# EAGLE schematic AP_Board_1 (EAGLE 7.2.0)
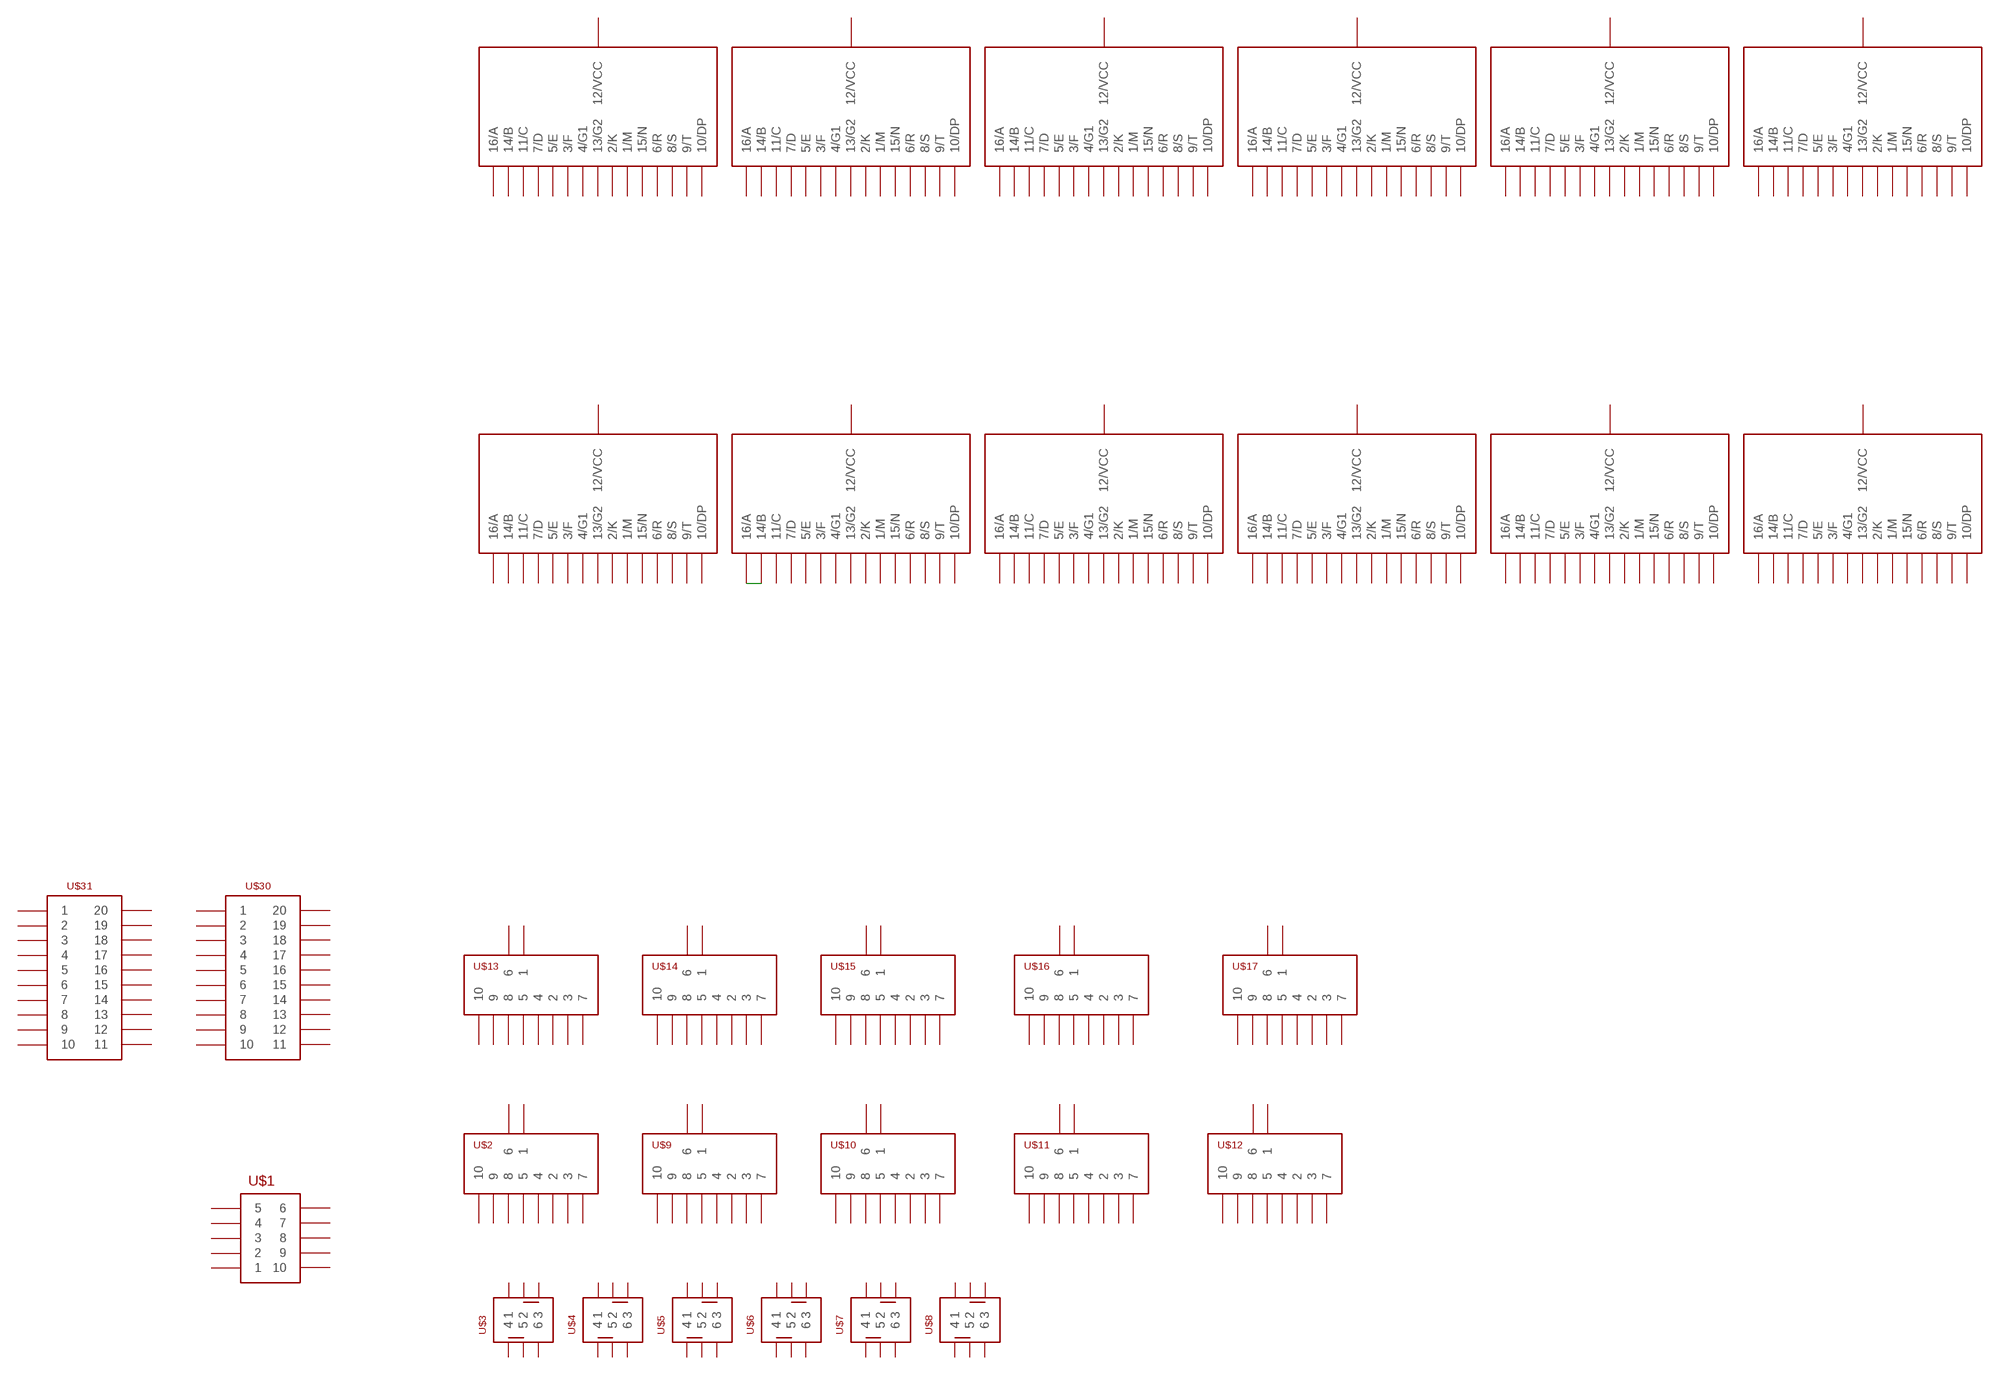
[diagram p0: schematic, sheet 1]

## Parts
U$1  ELMA_E37  [ELMA_E37]
U$2  SA3611EWA  [SA3611EWA]
U$3  P1-0S  [P1-0S]
U$4  P1-0S  [P1-0S]
U$5  P1-0S  [P1-0S]
U$6  P1-0S  [P1-0S]
U$7  P1-0S  [P1-0S]
U$8  P1-0S  [P1-0S]
U$9  SA3611EWA  [SA3611EWA]
U$10  SA3611EWA  [SA3611EWA]
U$11  SA3611EWA  [SA3611EWA]
U$12  SA3611EWA  [SA3611EWA]
U$13  SA3611EWA  [SA3611EWA]
U$14  SA3611EWA  [SA3611EWA]
U$15  SA3611EWA  [SA3611EWA]
U$16  SA3611EWA  [SA3611EWA]
U$17  SA3611EWA  [SA3611EWA]
U$18  PSA39-21EWA  [PSA39-21EWA]
U$19  PSA39-21EWA  [PSA39-21EWA]
U$20  PSA39-21EWA  [PSA39-21EWA]
U$21  PSA39-21EWA  [PSA39-21EWA]
U$22  PSA39-21EWA  [PSA39-21EWA]
U$23  PSA39-21EWA  [PSA39-21EWA]
U$24  PSA39-21EWA  [PSA39-21EWA]
U$25  PSA39-21EWA  [PSA39-21EWA]
U$26  PSA39-21EWA  [PSA39-21EWA]
U$27  PSA39-21EWA  [PSA39-21EWA]
U$28  PSA39-21EWA  [PSA39-21EWA]
U$29  PSA39-21EWA  [PSA39-21EWA]
U$30  LISTA_2X10  [LISTA_2X10]
U$31  LISTA_2X10  [LISTA_2X10]

## Nets
N$1: U$19.P$14(14/B) U$19.P$16(16/A)
Unconnected: U$1.1 U$1.2 U$1.3 U$1.4 U$1.5 U$1.6 U$1.7 U$1.8 U$1.9 U$1.10 U$2.1 U$2.2 U$2.3 U$2.4 U$2.5 U$2.6 U$2.7 U$2.8 U$2.9 U$2.10 U$3.1 U$3.2 U$3.3 U$3.4 U$3.5 U$3.6 U$4.1 U$4.2 U$4.3 U$4.4 U$4.5 U$4.6 U$5.1 U$5.2 U$5.3 U$5.4 U$5.5 U$5.6 U$6.1 U$6.2 U$6.3 U$6.4 U$6.5 U$6.6 U$7.1 U$7.2 U$7.3 U$7.4 U$7.5 U$7.6 U$8.1 U$8.2 U$8.3 U$8.4 U$8.5 U$8.6 U$9.1 U$9.2 U$9.3 U$9.4 U$9.5 U$9.6 U$9.7 U$9.8 U$9.9 U$9.10 U$10.1 U$10.2 U$10.3 U$10.4 U$10.5 U$10.6 U$10.7 U$10.8 U$10.9 U$10.10 U$11.1 U$11.2 U$11.3 U$11.4 U$11.5 U$11.6 U$11.7 U$11.8 U$11.9 U$11.10 U$12.1 U$12.2 U$12.3 U$12.4 U$12.5 U$12.6 U$12.7 U$12.8 U$12.9 U$12.10 U$13.1 U$13.2 U$13.3 U$13.4 U$13.5 U$13.6 U$13.7 U$13.8 U$13.9 U$13.10 U$14.1 U$14.2 U$14.3 U$14.4 U$14.5 U$14.6 U$14.7 U$14.8 U$14.9 U$14.10 U$15.1 U$15.2 U$15.3 U$15.4 U$15.5 U$15.6 U$15.7 U$15.8 U$15.9 U$15.10 U$16.1 U$16.2 U$16.3 U$16.4 U$16.5 U$16.6 U$16.7 U$16.8 U$16.9 U$16.10 U$17.1 U$17.2 U$17.3 U$17.4 U$17.5 U$17.6 U$17.7 U$17.8 U$17.9 U$17.10 U$18.P$1(1/M) U$18.P$2(2/K) U$18.P$3(3/F) U$18.P$4(4/G1) U$18.P$5(5/E) U$18.P$6(6/R) U$18.P$7(7/D) U$18.P$8(8/S) U$18.P$9(9/T) U$18.P$10(10/DP) U$18.P$11(11/C) U$18.P$12(12/VCC) U$18.P$13(13/G2) U$18.P$14(14/B) U$18.P$15(15/N) U$18.P$16(16/A) U$19.P$1(1/M) U$19.P$2(2/K) U$19.P$3(3/F) U$19.P$4(4/G1) U$19.P$5(5/E) U$19.P$6(6/R) U$19.P$7(7/D) U$19.P$8(8/S) U$19.P$9(9/T) U$19.P$10(10/DP) U$19.P$11(11/C) U$19.P$12(12/VCC) U$19.P$13(13/G2) U$19.P$15(15/N) U$20.P$1(1/M) U$20.P$2(2/K) U$20.P$3(3/F) U$20.P$4(4/G1) U$20.P$5(5/E) U$20.P$6(6/R) U$20.P$7(7/D) U$20.P$8(8/S) U$20.P$9(9/T) U$20.P$10(10/DP) U$20.P$11(11/C) U$20.P$12(12/VCC) U$20.P$13(13/G2) U$20.P$14(14/B) U$20.P$15(15/N) U$20.P$16(16/A) U$21.P$1(1/M) U$21.P$2(2/K) U$21.P$3(3/F) U$21.P$4(4/G1) U$21.P$5(5/E) U$21.P$6(6/R) U$21.P$7(7/D) U$21.P$8(8/S) U$21.P$9(9/T) U$21.P$10(10/DP) U$21.P$11(11/C) U$21.P$12(12/VCC) U$21.P$13(13/G2) U$21.P$14(14/B) U$21.P$15(15/N) U$21.P$16(16/A) U$22.P$1(1/M) U$22.P$2(2/K) U$22.P$3(3/F) U$22.P$4(4/G1) U$22.P$5(5/E) U$22.P$6(6/R) U$22.P$7(7/D) U$22.P$8(8/S) U$22.P$9(9/T) U$22.P$10(10/DP) U$22.P$11(11/C) U$22.P$12(12/VCC) U$22.P$13(13/G2) U$22.P$14(14/B) U$22.P$15(15/N) U$22.P$16(16/A) U$23.P$1(1/M) U$23.P$2(2/K) U$23.P$3(3/F) U$23.P$4(4/G1) U$23.P$5(5/E) U$23.P$6(6/R) U$23.P$7(7/D) U$23.P$8(8/S) U$23.P$9(9/T) U$23.P$10(10/DP) U$23.P$11(11/C) U$23.P$12(12/VCC) U$23.P$13(13/G2) U$23.P$14(14/B) U$23.P$15(15/N) U$23.P$16(16/A) U$24.P$1(1/M) U$24.P$2(2/K) U$24.P$3(3/F) U$24.P$4(4/G1) U$24.P$5(5/E) U$24.P$6(6/R) U$24.P$7(7/D) U$24.P$8(8/S) U$24.P$9(9/T) U$24.P$10(10/DP) U$24.P$11(11/C) U$24.P$12(12/VCC) U$24.P$13(13/G2) U$24.P$14(14/B) U$24.P$15(15/N) U$24.P$16(16/A) U$25.P$1(1/M) U$25.P$2(2/K) U$25.P$3(3/F) U$25.P$4(4/G1) U$25.P$5(5/E) U$25.P$6(6/R) U$25.P$7(7/D) U$25.P$8(8/S) U$25.P$9(9/T) U$25.P$10(10/DP) U$25.P$11(11/C) U$25.P$12(12/VCC) U$25.P$13(13/G2) U$25.P$14(14/B) U$25.P$15(15/N) U$25.P$16(16/A) U$26.P$1(1/M) U$26.P$2(2/K) U$26.P$3(3/F) U$26.P$4(4/G1) U$26.P$5(5/E) U$26.P$6(6/R) U$26.P$7(7/D) U$26.P$8(8/S) U$26.P$9(9/T) U$26.P$10(10/DP) U$26.P$11(11/C) U$26.P$12(12/VCC) U$26.P$13(13/G2) U$26.P$14(14/B) U$26.P$15(15/N) U$26.P$16(16/A) U$27.P$1(1/M) U$27.P$2(2/K) U$27.P$3(3/F) U$27.P$4(4/G1) U$27.P$5(5/E) U$27.P$6(6/R) U$27.P$7(7/D) U$27.P$8(8/S) U$27.P$9(9/T) U$27.P$10(10/DP) U$27.P$11(11/C) U$27.P$12(12/VCC) U$27.P$13(13/G2) U$27.P$14(14/B) U$27.P$15(15/N) U$27.P$16(16/A) U$28.P$1(1/M) U$28.P$2(2/K) U$28.P$3(3/F) U$28.P$4(4/G1) U$28.P$5(5/E) U$28.P$6(6/R) U$28.P$7(7/D) U$28.P$8(8/S) U$28.P$9(9/T) U$28.P$10(10/DP) U$28.P$11(11/C) U$28.P$12(12/VCC) U$28.P$13(13/G2) U$28.P$14(14/B) U$28.P$15(15/N) U$28.P$16(16/A) U$29.P$1(1/M) U$29.P$2(2/K) U$29.P$3(3/F) U$29.P$4(4/G1) U$29.P$5(5/E) U$29.P$6(6/R) U$29.P$7(7/D) U$29.P$8(8/S) U$29.P$9(9/T) U$29.P$10(10/DP) U$29.P$11(11/C) U$29.P$12(12/VCC) U$29.P$13(13/G2) U$29.P$14(14/B) U$29.P$15(15/N) U$29.P$16(16/A) U$30.1 U$30.2 U$30.3 U$30.4 U$30.5 U$30.6 U$30.7 U$30.8 U$30.9 U$30.10 U$30.11 U$30.12 U$30.13 U$30.14 U$30.15 U$30.16 U$30.17 U$30.18 U$30.19 U$30.20 U$31.1 U$31.2 U$31.3 U$31.4 U$31.5 U$31.6 U$31.7 U$31.8 U$31.9 U$31.10 U$31.11 U$31.12 U$31.13 U$31.14 U$31.15 U$31.16 U$31.17 U$31.18 U$31.19 U$31.20

## Library data of the parts
U$1 = RadioStack_v2:ELMA_E37
U$2 U$9-U$17 = RadioStack_v2:SA3611EWA
U$3-U$8 = RadioStack_v2:P1-0S
U$18-U$29 = RadioStack_v2:PSA39-21EWA
U$30 U$31 = RadioStack_v2:LISTA_2X10